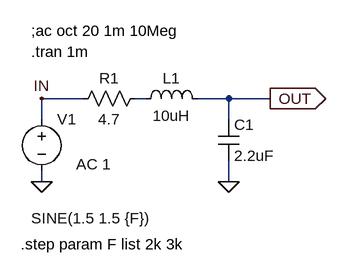
[diagram p0: schematic ArduinoLFO_RLC_LPF_2.2uF.asc]
ArduinoLFO_RLC_LPF_2.2uF.asc, the LTspice schematic file:
Version 4
SHEET 1 1028 680
WIRE 256 96 192 96
WIRE 352 96 336 96
WIRE 480 96 432 96
WIRE 544 96 480 96
WIRE 192 128 192 96
WIRE 480 128 480 96
WIRE 192 224 192 208
WIRE 480 224 480 192
FLAG 192 224 0
FLAG 192 96 IN
FLAG 480 224 0
FLAG 544 96 OUT
IOPIN 544 96 Out
SYMBOL voltage 192 112 R0
WINDOW 3 -16 168 Left 2
WINDOW 123 53 85 Left 2
WINDOW 39 0 0 Left 2
SYMATTR Value SINE(1.5 1.5 {F})
SYMATTR Value2 AC 1
SYMATTR InstName V1
SYMBOL ind 336 112 R270
WINDOW 0 32 56 VTop 2
WINDOW 3 5 56 VBottom 2
SYMATTR InstName L1
SYMATTR Value 10uH
SYMBOL cap 464 128 R0
SYMATTR InstName C1
SYMATTR Value 2.2uF
SYMBOL res 352 80 R90
WINDOW 0 0 56 VBottom 2
WINDOW 3 32 56 VTop 2
SYMATTR InstName R1
SYMATTR Value 4.7
TEXT 176 24 Left 2 !.tran 1m
TEXT 176 -8 Left 2 !;ac oct 20 1m 10Meg
TEXT 160 320 Left 2 !.step param F list 2k 3k

The netlist it stands for:
* ArduinoLFO_RLC_LPF_2.2uF.asc
V1 IN 0 SINE(1.5 1.5 {F}) AC 1
L1 N001 OUT 10uH
C1 OUT 0 2.2uF
R1 N001 IN 4.7
.tran 1m
;ac oct 20 1m 10Meg
.step param F list 2k 3k
.backanno
.end